# EAGLE design NanoRS485-MySens-v024 (EAGLE 7.6.0)
MAPLE-CUx Large Version
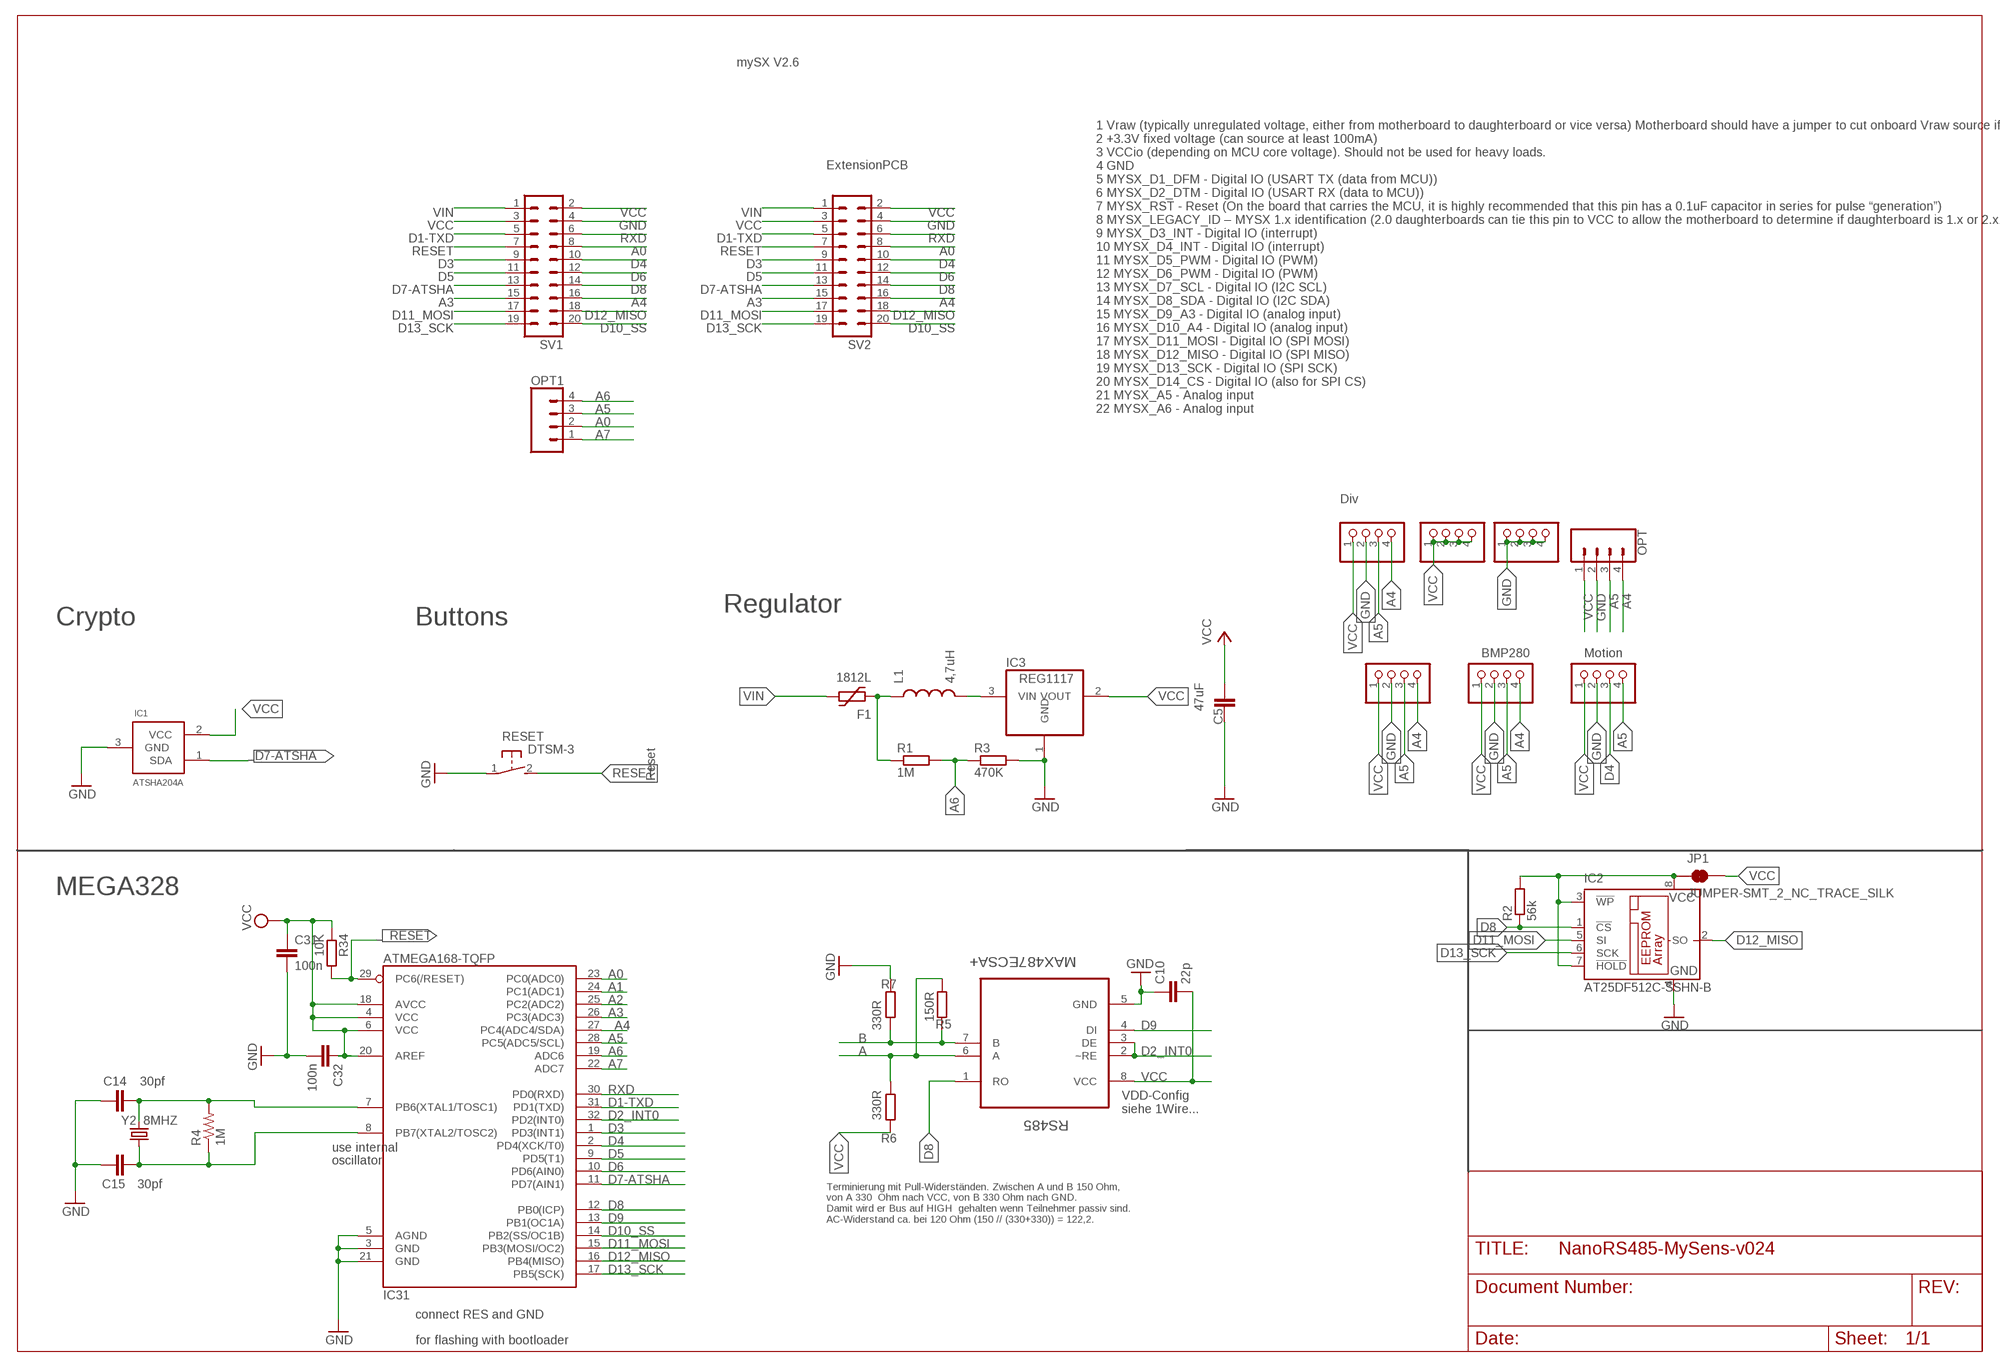
[diagram p0: schematic, sheet 1, part 1 of 2]
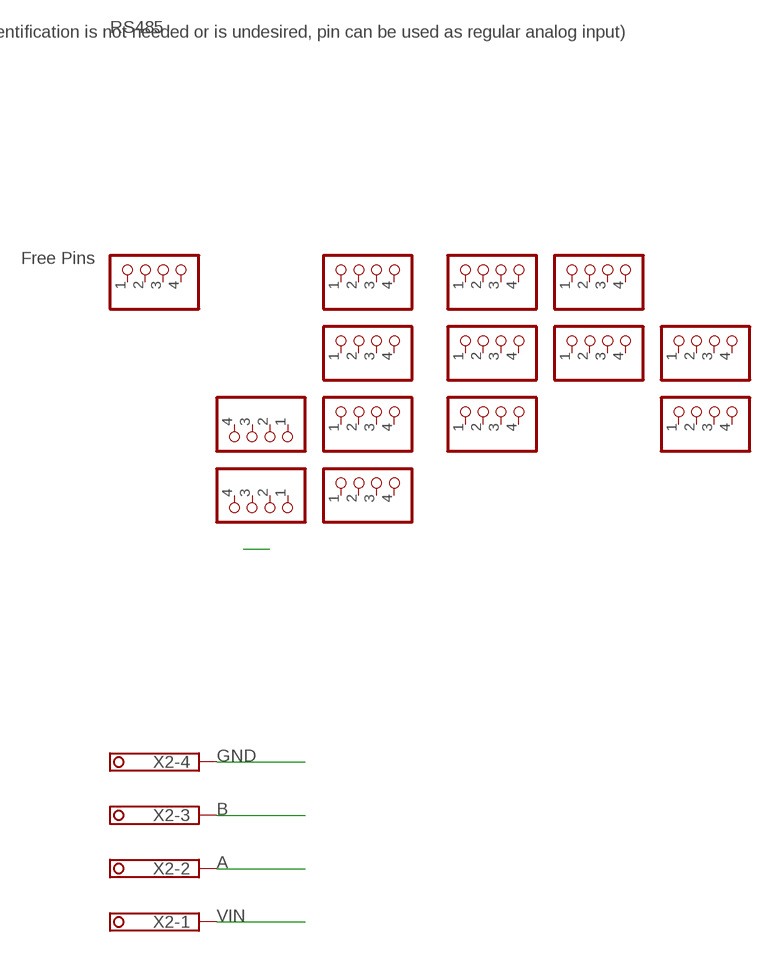
[diagram p1: schematic, sheet 1, part 2 of 2]

## Parts
BH1750  PINHD-1X04_2.54-S  [1X04-S]
C5  47uF  C-EUC1210  [C1210]
C10  22p  C-EUC0805  [C0805]
C14  30pf  CAP0805  [0805]
C15  30pf  CAP0805  [0805]
C31  100n  C-EUC0805  [C0805]
C32  100n  C-EUC0805  [C0805]
F1  1812L  [1812L]
I2C-1  PINHD-1X04_2.54-S  [1X04-S]
I2C-2  PINHD-1X04_2.54-S  [1X04-S]
IC1  ATSHA204A  [SOT23]
IC2  AT25DF512C-SSHN-B  25AA080SN  [SO-08]
IC3  REG1117  [SOT223]
IC31  ATMEGA168-TQFP  [TQFP32-08]
JP1  JUMPER-SMT_2_NC_TRACE_SILK  [SMT-JUMPER_2_NC_TRACE_SILK]
JP2  PINHD-1X04_2.54-S  [1X04-S]
JP3  PINHD-1X04_2.54-S  [1X04-S]
JP5  PINHD-1X04_2.54-S  [1X04-S]
JP6  PINHD-1X04_2.54-S  [1X04-S]
JP7  PINHD-1X04_2.54-S  [1X04-S]
JP8  PINHD-1X04_2.54-S  [1X04-S]
JP10  PINHD-1X04_2.54-S  [1X04-S]
JP13  PINHD-1X04_2.54-S  [1X04-S]
JP14  PINHD-1X04_2.54-S  [1X04-S]
JP15  PINHD-1X04_2.54-S  [1X04-S]
JP16  PINHD-1X04_2.54-S  [1X04-S]
JP18  PINHD-1X04_2.54-S  [1X04-S]
JP19  PINHD-1X04_2.54-S  [1X04-S]
JP20  PINHD-1X04_2.54-S  [1X04-S]
JP21  PINHD-1X04_2.54-S  [1X04-S]
JP23  PINHD-1X04_2.54-S  [1X04-S]
L1  4,7uH  INDUCTOR0805  [0805]
MOTION  PINHD-1X04_2.54-S  [1X04-S]
OPT  CONN_04  [1X04]
OPT1  CONN_04  [1X04]
R1  1M  R-EU_R0805  [R0805]
R2  56k  R-EU_M0805  [M0805]
R3  470K  R-EU_R0805  [R0805]
R4  1M  RESISTOR0805-RES  [0805]
R5  150R  R-EU_R0805  [R0805]
R6  330R  R-EU_R0805  [R0805]
R7  330R  R-EU_R0805  [R0805]
R34  10K  R-EU_R0805  [R0805]
RESET  DTSM-3  [DTSM-3]
RS485  MAX487ECSA+  [SOIC127P600X175-8N]
SV1  MA10-2  [MA10-2]
SV2  MA10-2  [MA10-2]
X2  1751264  [1751264]
Y2  8MHZ  CRYSTALTXC-7A  [CRYSTAL-TXC-7A]

## Nets
A: R5.1 R6.2 RS485.6(A) X2.2
A0: IC31.23(PC0(ADC0)) OPT1.2 SV1.8 SV2.8
A1: IC31.24(PC1(ADC1))
A2: IC31.25(PC2(ADC2))
A3: IC31.26(PC3(ADC3)) SV1.15 SV2.15
A4: BH1750.4 I2C-1.4 I2C-2.4 IC31.27(PC4(ADC4/SDA)) OPT.4 SV1.16 SV2.16
A5: BH1750.3 I2C-1.3 I2C-2.3 IC31.28(PC5(ADC5/SCL)) MOTION.4 OPT1.3 OPT.3
A6: IC31.19(ADC6) OPT1.4 R1.2 R3.1
A7: IC31.22(ADC7) OPT1.1
B: R5.2 R7.1 RS485.7(B) X2.3
D1-TXD: IC31.31(PD1(TXD)) SV1.5 SV2.5
D2_INT0: IC31.32(PD2(INT0)) RS485.2(~RE) RS485.3(DE)
D3: IC31.1(PD3(INT1)) SV1.9 SV2.9
D4: IC31.2(PD4(XCK/T0)) MOTION.3 SV1.10 SV2.10
D5: IC31.9(PD5(T1)) SV1.11 SV2.11
D6: IC31.10(PD6(AIN0)) SV1.12 SV2.12
D7-ATSHA: IC1.1(SDA) IC31.11(PD7(AIN1)) SV1.13 SV2.13
D8: IC2.1(!CS) IC31.12(PB0(ICP)) R2.1 RS485.1(RO) SV1.14 SV2.14
D9: IC31.13(PB1(OC1A)) RS485.4(DI)
D10_SS: IC31.14(PB2(SS/OC1B)) SV1.20 SV2.20
D11_MOSI: IC2.5(SI) IC31.15(PB3(MOSI/OC2)) SV1.17 SV2.17
D12_MISO: IC2.2(SO) IC31.16(PB4(MISO)) SV1.18 SV2.18
D13_SCK: IC2.6(SCK) IC31.17(PB5(SCK)) SV1.19 SV2.19
GND [PWR]: BH1750.2 C5.1 C10.1 C14.1 C15.1 C31.2 C32.2 I2C-1.2 I2C-2.2 IC1.3(GND) IC2.4(GND) IC3.1(GND) IC31.3(GND) IC31.5(AGND) IC31.21(GND) JP2.1 JP2.2 JP2.3 JP2.4 MOTION.2 OPT.2 R3.2 R7.2 RESET.1 RS485.5(GND) SV1.4 SV2.4 X2.4
N$3: C14.2 IC31.7(PB6(XTAL1/TOSC1)) R4.2 Y2.P$2
N$19: C15.2 IC31.8(PB7(XTAL2/TOSC2)) R4.1 Y2.P$1
RAW: IC3.3(VIN) L1.2
RESET: IC31.29(PC6(/RESET)) R34.2 RESET.2 SV1.7 SV2.7
RXD: IC31.30(PD0(RXD)) SV1.6 SV2.6
VCC [PWR]: BH1750.1 C5.2 C10.2 C31.1 C32.1 I2C-1.1 I2C-2.1 IC1.2(VCC) IC3.2(VOUT) IC31.4(VCC) IC31.6(VCC) IC31.18(AVCC) IC31.20(AREF) JP1.2 JP3.1 JP3.2 JP3.3 JP3.4 MOTION.1 OPT.1 R6.1 R34.1 RS485.8(VCC) SV1.2 SV1.3 SV2.2 SV2.3
VCC1 [PWR]: IC2.3(!WP) IC2.7(!HOLD) IC2.8(VCC) JP1.1 R2.2
VIN [PWR]: F1.P$2 SV1.1 SV2.1 X2.1
VIN-FUSED [PWR]: F1.P$1 L1.1 R1.1
Unconnected: JP5.1 JP5.2 JP5.3 JP5.4 JP6.1 JP6.2 JP6.3 JP6.4 JP7.1 JP7.2 JP7.3 JP7.4 JP8.1 JP8.2 JP8.3 JP8.4 JP10.1 JP10.2 JP10.3 JP10.4 JP13.1 JP13.2 JP13.3 JP13.4 JP14.1 JP14.2 JP14.3 JP14.4 JP15.1 JP15.2 JP15.3 JP15.4 JP16.1 JP16.2 JP16.3 JP16.4 JP18.1 JP18.2 JP18.3 JP18.4 JP19.1 JP19.2 JP19.3 JP19.4 JP20.1 JP20.2 JP20.3 JP20.4 JP21.1 JP21.2 JP21.3 JP21.4 JP23.1 JP23.2 JP23.3 JP23.4

## Notes on the sheet
- mySX V2.6
- ExtensionPCB
- RS485
- Free Pins
- 1 Vraw (typically unregulated voltage, either from motherboard to daughterboard or vice versa) Motherboard should have a jumper to cut onboard Vraw source if daughterboard provides Vraw. Be sure to check motherboard constraints on Vraw before connecting a daughterboard that provides Vraw (for over voltage protection). Should be able to source at least 100mA and all boards are recommended to support a voltage up to 24V on this pin.
  2 +3.3V fixed voltage (can source at least 100mA)
  3 VCCio (depending on MCU core voltage). Should not be used for heavy loads.
  4 GND
  5 MYSX_D1_DFM - Digital IO (USART TX (data from MCU))
  6 MYSX_D2_DTM - Digital IO (USART RX (data to MCU))
  7 MYSX_RST - Reset (On the board that carries the MCU, it is highly recommended that this pin has a 0.1uF capacitor in series for pulse “generation”)
  8 MYSX_LEGACY_ID – MYSX 1.x identification (2.0 daughterboards can tie this pin to VCC to allow the motherboard to determine if daughterboard is 1.x or 2.x. If identification is not needed or is undesired, pin can be used as regular analog input)
  9 MYSX_D3_INT - Digital IO (interrupt)
  10 MYSX_D4_INT - Digital IO (interrupt)
  11 MYSX_D5_PWM - Digital IO (PWM)
  12 MYSX_D6_PWM - Digital IO (PWM)
  13 MYSX_D7_SCL - Digital IO (I2C SCL)
  14 MYSX_D8_SDA - Digital IO (I2C SDA)
  15 MYSX_D9_A3 - Digital IO (analog input)
  16 MYSX_D10_A4 - Digital IO (analog input)
  17 MYSX_D11_MOSI - Digital IO (SPI MOSI)
  18 MYSX_D12_MISO - Digital IO (SPI MISO)
  19 MYSX_D13_SCK - Digital IO (SPI SCK)
  20 MYSX_D14_CS - Digital IO (also for SPI CS)
  21 MYSX_A5 - Analog input
  22 MYSX_A6 - Analog input
- Div
- Regulator
- Crypto | Buttons
- BMP280 | Motion
- Reset
- MEGA328
- VDD-Config
  siehe 1Wire...
- use internal
- oscillator
- Terminierung mit Pull-Widerständen. Zwischen A und B 150 Ohm,
  von A 330  Ohm nach VCC, von B 330 Ohm nach GND. 
  Damit wird er Bus auf HIGH  gehalten wenn Teilnehmer passiv sind.
  AC-Widerstand ca. bei 120 Ohm (150 // (330+330)) = 122,2.
- connect RES and GND
- for flashing with bootloader

## Library data of the parts
BH1750 I2C-1 I2C-2 JP2 JP3 JP5-JP8 JP10 JP13-JP16 JP18-JP21 JP23 MOTION = pinhead-2:PINHD-1X04: PIN HEADER
C5 C10 C31 C32 = rcl:C-EU: CAPACITOR, European symbol
C14 C15 = doug:CAP: Capacitor Standard 0603 ceramic capacitor, and 0.1" leaded capacitor.
F1 = ptc-littlefuse:1812L
IC1 = Sensor:ATSHA204A
IC2 = microchip:25*: Serial EEPROM 4K/ 8K , SPI bus; MF: MICROCHIP; MPN: 25AA080/SN; OC_FARNELL: 1816072; OC_NEWARK: 92C7351
IC3 = burr-brown:REG1117: 800mA and 1A Low Dropout (LDO) Positive Regulator 1.8V, 2.5V, 2.85V, 3.3V, 5V, and Adj; MPN: REG1117; OC_FARNELL: 1097566; OC_NEWARK: 14P6981
IC31 = atmel:ATMEGA168: Atmel Atmega 168/328/328P
JP1 = SparkFun-Jumpers:JUMPER-SMT_2_NC_TRACE: Normally closed trace jumper This jumper has a trace between two pads so it's normally closed (NC). Use a razor knife to open the connection. For best results follow the IPC guidelines for cutting traces: Cutout at least 0.063 mm (0.005 in). Remove all loose material to clean up the cut area. Seal the cut with an approved epoxy. Reapply solder to reclose the connection.
L1 = SparkFun-Passives:INDUCTOR: Inductors Basic Inductor/Choke - 0603 and 1206. Footprints are not proven and vary greatly between part numbers.
OPT OPT1 = SparkFun-Connectors:CONN_04: Multi connection point. Often used as Generic Header-pin footprint for 0.1 inch spaced/style header connections On any of the 0.1 inch spaced packages, you can populate with these: Break Away Headers - Straight <https://www.sparkfun.com/products/116> (PRT-00116) Break Away Male Headers - Right Angle <https://www.sparkfun.com/products/553> (PRT-00553) Female Headers <https://www.sparkfun.com/products/115> (PRT-00115) Break Away Headers - Machine Pin <https://www.sparkfun.com/products/117> (PRT-00117) Break Away Female Headers - Swiss Machine Pin <https://www.sparkfun.com/products/743> (PRT-00743) For SCREWTERMINALS and SPRING TERMINALS visit here: Screw Terimnals on SparkFun.com <https://www.sparkfun.com/search/results?term=Screw+Terminals> (5mm/3.5mm/2.54mm spacing) This device is also useful as a general connection point to wire up your design to another part of your project. Our various solder wires solder well into these plated through hole pads. Hook-Up Wire - Assortment (Stranded, 22 AWG) <https://www.sparkfun.com/products/11375> (PRT-11375) Hook-Up Wire - Assortment (Solid Core, 22 AWG) <https://www.sparkfun.com/products/11367> (PRT-11367) View the entire wire category on our website here <https://www.sparkfun.com/categories/141> Special notes: Molex polarized connector foot print use with SKU : PRT-08231 with associated crimp pins and housings. 1MM SMD Version SKU: PRT-10208; PROD_ID: CONN-09696
R1 R3 R5-R7 R34 = rcl:R-EU_: RESISTOR, European symbol
R2 = resistor:R-EU_: RESISTOR, European symbol
R4 = doug:RESISTOR: Resistor Basic schematic elements and footprints for 0603, 1206, and PTH resistors.
RESET = mechanics:DTSM-3: Diptronics SMD button 6x3.5 mm
RS485 = Maxim_By_element14_Batch_1:MAX487ECSA+: Low-Power, Slew-Rate-Limited RS-485/RS-422 Transceivers; MPN: MAX487ECSA+; OC_FARNELL: 9724532; OC_NEWARK: 68K4803; PACKAGE: SOIC-8; SUPPLIER: Maxim
SV1 SV2 = con-lstb:MA10-2: PIN HEADER; OC_FARNELL: unknown; OC_NEWARK: unknown
X2 = con-phoenix-350:1751264: MKDS 1/ 4-3,5 Printklemme Nennstrom: 10 A Bemessungsspannung: 160 V Raster: 3,5 mm Polzahl: 4 Montageart: Löten Anschlussart: Schraubanschluss Anschlussrichtung vom Leiter zur Platine: 0° Source: http://eshop.phoenixcontact.com .. 1751264.pdf; MPN: 1751264; OC_FARNELL: unknown; OC_NEWARK: 10R0934
Y2 = SparkFun-FreqCtrl:CRYSTAL: Various standard crystals. Proven footprints.

## Net classes
0 default: width 0.254 mm
1 PWR: width 0.406 mm

## Board
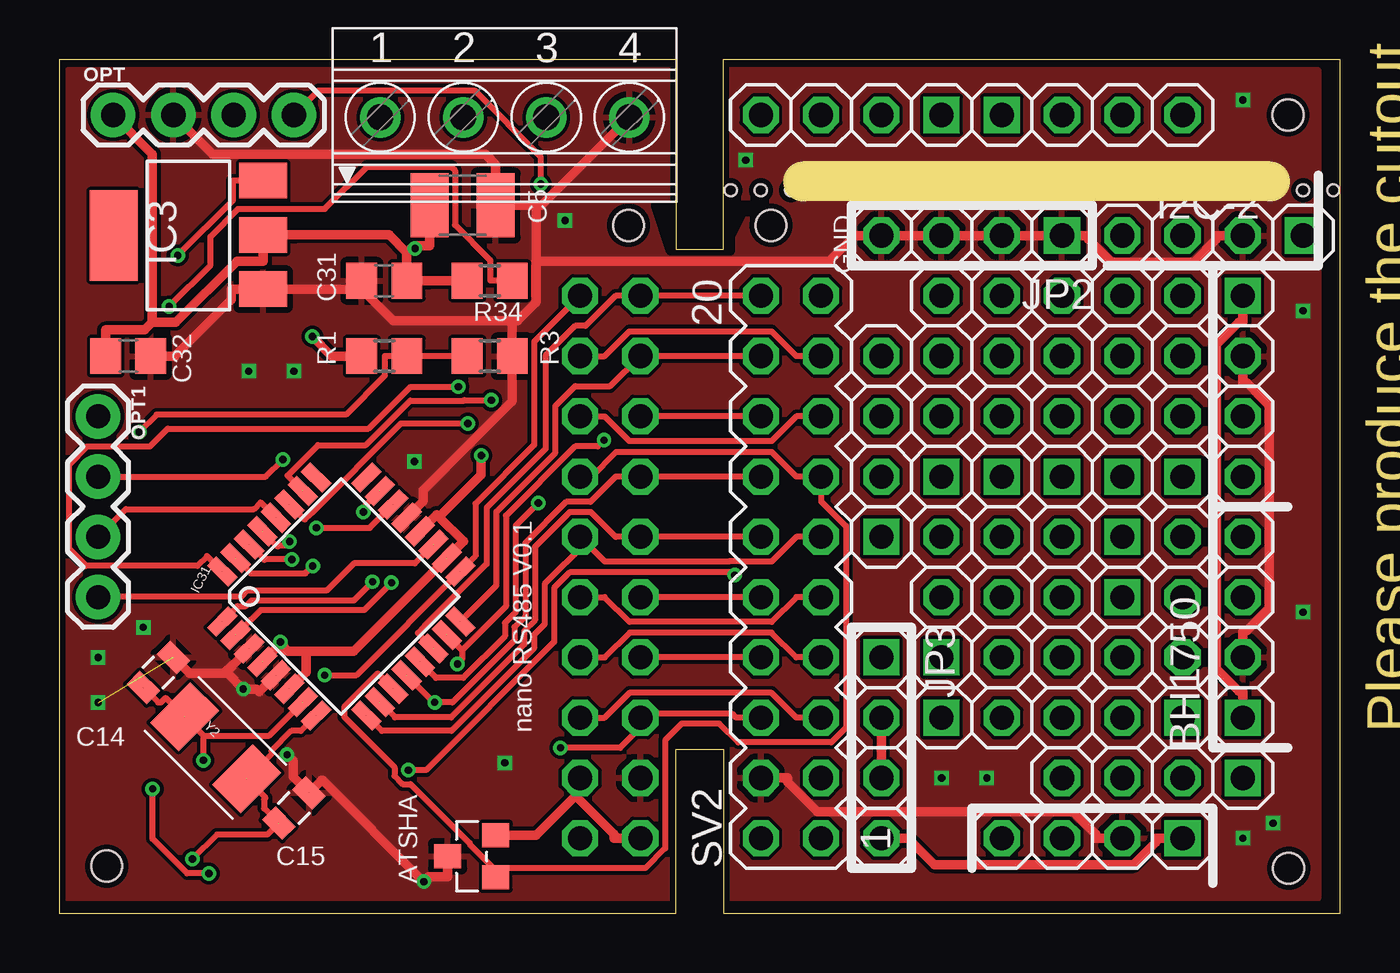
[diagram p2: board, top side]
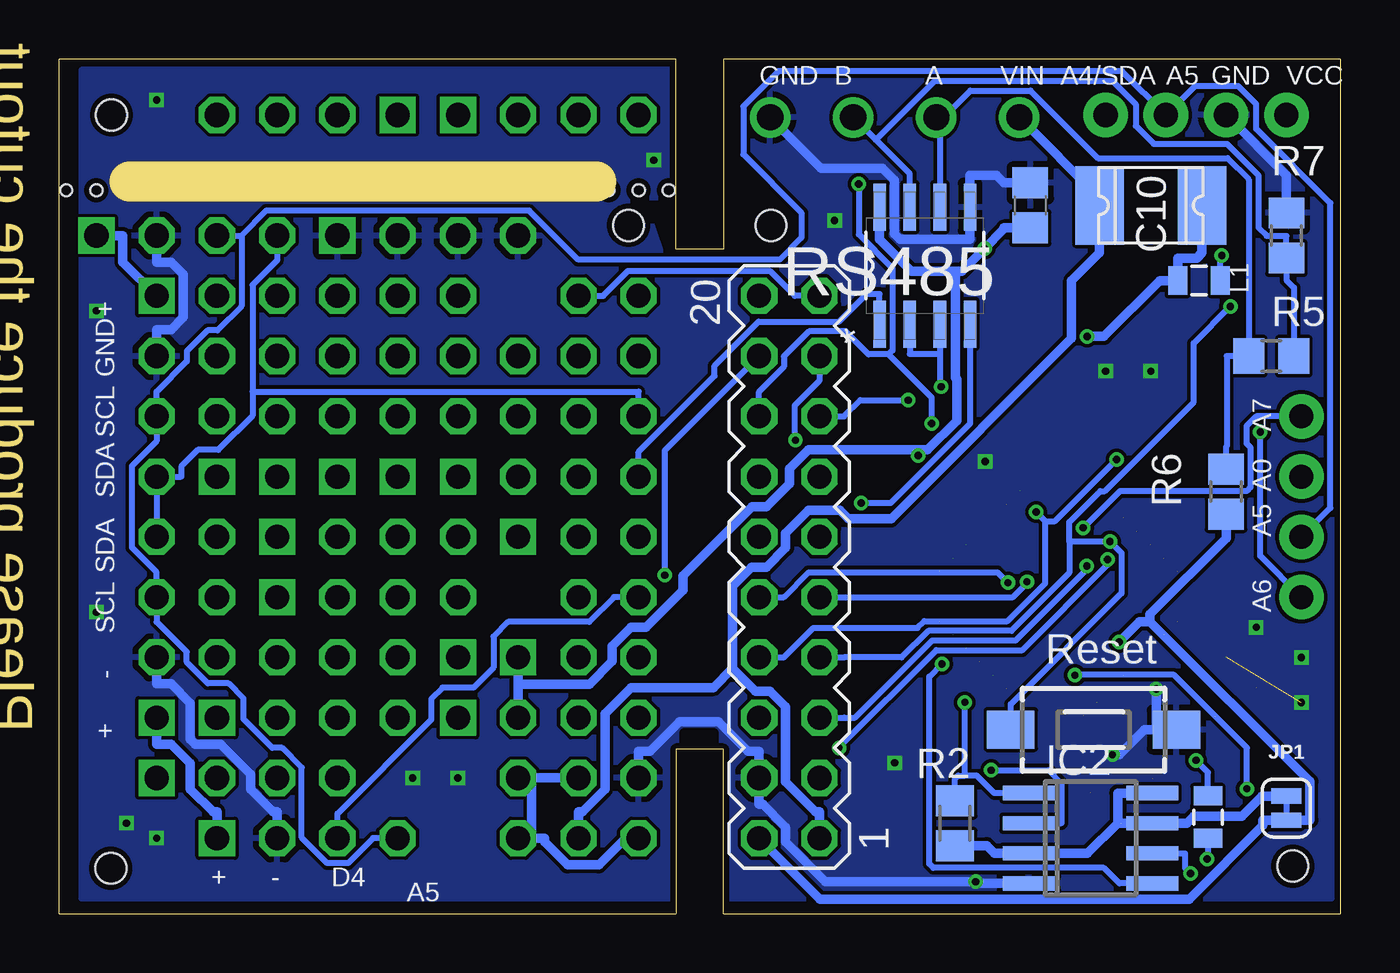
[diagram p3: board, bottom side, seen from below]

Size 54 x 36 mm. Coordinates in mm from the lower left corner, seen from the top.
Outline: 26,0 0,0 0,36 26,36 26,28 28,28 28,36 54,36 54,0 28,0 28,6.92 26,6.92 26,0
Copper layers (1*16): Top 0.035mm / dielectric 1.5mm / Bottom 0.035mm
Design rules "SeeedStudio_2layer_DRU_no_angle_20140221": minimum track width 6mil, minimum drill 12mil, track to track 6mil, track to pad 6mil, pad to pad 6mil, via to via 6mil, smd to smd 0mil, copper to edge 10mil, drill to drill 10mil, minimum pad ring 10mil, minimum via ring 6mil, stop-mask expansion 2mil, vias tented up to drill 100mil, thermal gap 10mil
Holes 1.3 mm at 24,29 2,2 30,29 51.83,1.91 51.8,33.66
Holes 0.5 mm at 28.3,30.48 30.84,30.48 29.57,30.48 52.44,30.48 53.7,30.48
tRestrict: area 25.1,27.9 to 28.9,29.8; area 26.4,7 to 27.7,7.6
bRestrict: area 25.1,27.9 to 28.9,29.8; area 26.4,7 to 27.7,7.6
Milling: 1 lines

### Footprints (pad centres in the part's own frame; a part is rotated, then mirrored left to right if it is on the bottom)
1X04-S = drill 1.016 square: 1 -3.81,0 | drill 1.016 octagon: 2 -1.27,0; 3 1.27,0; 4 3.81,0
C1210 = smd 1.6 x 2.7: 1 -1.4,0; 2 1.4,0
C0805 = smd 1.3 x 1.5: 1 -0.95,0; 2 0.95,0
0805 = smd 0.8 x 1.2: 1 -0.9,0; 2 0.9,0
1812L = smd 2.03 x 3.3: P$1 -2.16,0; P$2 2.16,0
SOT23 = smd 1.016 x 1.143: 1 -0.889,-1.016; 2 0.889,-1.016; 3 0,1.016
SO-08 = smd 0.6 x 2.2: 1 -1.905,-2.6; 2 -0.635,-2.6; 3 0.635,-2.6; 4 1.905,-2.6; 5 1.905,2.6; 6 0.635,2.6; 7 -0.635,2.6; 8 -1.905,2.6
SOT223 = smd 1.499 x 2.007: 1 -2.261,-3.15; 2 0.025,-3.15; 3 2.311,-3.15 | smd 3.81 x 2.007: 4 0,3.15
TQFP32-08 = smd 1.27 x 0.559: 1 -4.293,2.8; 2 -4.293,2; 3 -4.293,1.2; 4 -4.293,0.4; 5 -4.293,-0.4; 6 -4.293,-1.2; 7 -4.293,-2; 8 -4.293,-2.8; 17 4.293,-2.8; 18 4.293,-2; 19 4.293,-1.2; 20 4.293,-0.4; 21 4.293,0.4; 22 4.293,1.2; 23 4.293,2; 24 4.293,2.8 | smd 0.559 x 1.27: 9 -2.8,-4.293; 10 -2,-4.293; 11 -1.2,-4.293; 12 -0.4,-4.293; 13 0.4,-4.293; 14 1.2,-4.293; 15 2,-4.293; 16 2.8,-4.293; 25 2.8,4.293; 26 2,4.293; 27 1.2,4.293; 28 0.4,4.293; 29 -0.4,4.293; 30 -1.2,4.293; 31 -2,4.293; 32 -2.8,4.293
SMT-JUMPER_2_NC_TRACE_SILK = smd 0.635 x 1.27: 1 -0.508,0; 2 0.508,0
1X04 = drill 1.016 pad 1.88: 1 0,0; 2 2.54,0; 3 5.08,0; 4 7.62,0
R0805 = smd 1.3 x 1.5: 1 -0.95,0; 2 0.95,0
M0805 = smd 1.3 x 1.6: 1 -0.95,0; 2 0.95,0
DTSM-3 = smd 2 x 1.6: 1 -3.494,0; 2 3.494,0
SOIC127P600X175-8N = smd 1.981 x 0.533: 1 -2.464,1.905; 2 -2.464,0.635; 3 -2.464,-0.635; 4 -2.464,-1.905; 5 2.464,-1.905; 6 2.464,-0.635; 7 2.464,0.635; 8 2.464,1.905
MA10-2 = drill 1.016 octagon: 1 -11.43,-1.27; 2 -11.43,1.27; 3 -8.89,-1.27; 4 -8.89,1.27; 5 -6.35,-1.27; 6 -6.35,1.27; 7 -3.81,-1.27; 8 -3.81,1.27; 9 -1.27,-1.27; 10 -1.27,1.27; 11 1.27,-1.27; 12 1.27,1.27; 13 3.81,-1.27; 14 3.81,1.27; 15 6.35,-1.27; 16 6.35,1.27; 17 8.89,-1.27; 18 8.89,1.27; 19 11.43,-1.27; 20 11.43,1.27
1751264 = drill 1.1 pad 1.7: 1 -5.25,-0.1; 2 -1.75,-0.1; 3 1.75,-0.1; 4 5.25,-0.1
CRYSTAL-TXC-7A = smd 1.7 x 2.4: P$1 1.85,0; P$2 -1.85,0

### Placement (x,y rotation side)
BH1750  49.9,12.06 90 top
C5  17,29.84 180 top
C10  13.06,29.84 270 bottom
C14  4.17,10.16 225 top
C15  9.89,4.45 225 top
C31  13.7,26.67 180 top
C32  2.91,23.5 0 top
F1  7.99,29.84 180 bottom
I2C-1  49.9,22.23 270 top
I2C-2  48.62,28.57 180 top
IC1  17.38,2.41 90 top
IC2  10.53,3.17 270 bottom
IC3  5.45,28.57 90 top
IC31  11.89,13.36 45 top
JP1  2.27,4.45 270 bottom
JP2  38.47,28.57 180 top
JP3  34.66,6.99 270 top
JP5  43.55,33.66 0 top
JP6  37.2,22.23 90 top
JP7  41.01,8.26 0 top
JP8  39.73,22.23 90 top
JP10  41.01,15.88 180 top
JP13  42.27,22.23 90 top
JP14  44.81,22.23 90 top
JP15  47.35,22.23 90 top
JP16  33.38,33.66 180 top
JP18  34.66,19.68 90 top
JP19  47.35,12.06 90 top
JP20  46.09,5.71 180 top
JP21  41.01,13.34 180 top
JP23  41.01,10.79 0 top
L1  5.95,26.67 0 bottom
MOTION  43.55,3.17 180 top
OPT  2.27,33.66 0 top
OPT1  1.64,20.95 270 top
R1  13.7,23.5 0 top
R2  16.24,3.81 270 bottom
R3  18.14,23.5 0 top
R4  5.57,4.06 90 bottom
R5  2.91,23.5 0 bottom
R6  4.81,17.78 90 bottom
R7  2.27,28.57 90 bottom
R34  18.14,26.67 0 top
RESET  10.4,7.75 180 bottom
RS485  17.51,27.3 90 bottom
SV1  23.23,14.61 90 bottom
SV2  30.84,14.61 90 top
X2  18.78,33.66 0 top
Y2  6.59,6.99 315 top

### Tracks (layer width: path | path; a pad name or v marks a point on that pad's centre or on a via)
A
  Bottom 0.254: R6.2 4.81,19.66 4.78,19.68 4.78,23.5 R5.1 3.85,30.94 4.75,31.83 10.21,31.83 13.06,34.69 15.59,34.69 16.88,33.4 | 16.88,33.4 RS485.6 | X2.2 16.88,33.4
A0  (via drill 0.3 pad 0.61)  (1 unrouted)
  Top 0.254: OPT1.2 8.71,18.41 v9.43,19.13 | v12.82,16.93 12.86,16.97 12.86,17.16 | 12.86,17.16 | IC31.23 12.86,17.16 | SV2.8 SV1.8
  Bottom 0.254: 12.43,16.54 v12.82,16.93 | 12.43,16.54 12.43,13.92 14.03,12.32 17.53,12.32 17.82,12.04 22.21,12.04 23.45,10.79 SV1.8 | 12.43,16.54 12.02,16.54 v9.43,19.13
A3  (via drill 0.3 pad 0.61)  (1 unrouted)
  Top 0.254: v18.21,21.64 17.09,21.64 17.07,21.62 14.79,21.62 12.92,19.74 10.9,19.74 9.62,18.46 IC31.26 | SV1.15 23,20.95 24.04,19.91 30.03,19.91 31.07,20.95 SV2.15
  Bottom 0.254: v18.21,21.64 20.23,21.64 20.91,20.95 SV1.15
A4  (via drill 0.3 pad 0.61)  (1 unrouted)
  Top 0.254: 16.94,20.66 14.41,20.66 10.63,16.88 10.35,16.6 IC31.27 | 16.94,20.66 | 16.94,20.66 v17.22,20.66 | OPT.4 10.92,34.69 17.5,34.69 20.3,31.89 v20.3,30.75 | SV2.16 SV1.16
  Bottom 0.254: v17.22,20.66 17.22,21.74 19.04,23.56 | 19.04,23.56 19.88,23.56 20.86,24.54 22.39,24.54 23.45,23.48 23.45,23.04 24.5,22 SV1.16 | v20.3,30.75 20.3,28.62 18.87,27.19 18.87,23.73 19.04,23.56 | 45.86,22 45.86,20.98 47.29,19.54 48.16,19.54 48.85,18.85 48.85,18.41 I2C-1.4 BH1750.4 | 45.86,22 45.86,26.49 44.81,27.53 I2C-2.4 | 45.86,22 29.57,22 SV2.16
A5  (1 unrouted)
  Top 0.254: IC31.28 8.49,17.33 8.2,17.04 2.8,17.04 OPT1.3
  Bottom 0.254: OPT1.3 0.42,17.09 0.42,29.94 3.54,33.07 3.54,34.11 4.3,34.88 6.13,34.88 OPT.3 9.2,35.5 23.68,35.5 25.16,34.02 25.16,31.99 22.71,29.54 22.71,28.47 23.62,27.56 32.13,27.56 34.19,29.62 45.27,29.62 46.31,28.57 | 46.31,28.57 46.31,25.6 47.34,24.58 47.75,24.58 48.62,23.7 48.62,23.27 49.9,22 I2C-1.3 49.9,19.91 50.94,18.87 50.94,15.42 49.9,14.38 BH1750.3 49.9,12.29 48.62,11.02 48.62,10.59 47.74,9.7 46.87,9.7 46.23,9.05 46.23,8.19 45.02,6.99 44.61,6.99 43.77,6.15 43.77,3.2 42.7,2.13 41.82,2.13 40.78,3.17 MOTION.4 | I2C-2.3 46.31,28.57
A6  (via drill 0.3 pad 0.61)  (1 unrouted)
  Top 0.254: IC31.19 14.98,14.76 12.42,14.76 11.27,13.61 7.93,13.61 7.68,13.36 1.66,13.36 OPT1.4 | v3.37,20.3 4.11,21.03 12.08,21.03 13.72,22.67 13.72,23.5 R1.2 R3.1
  Bottom 0.254: OPT1.4 3.37,15.07 v3.37,20.3
A7  (via drill 0.3 pad 0.61)  (1 unrouted)
  Top 0.254: v10.83,16.25 13.08,16.25 IC31.22
  Bottom 0.254: OPT1.1 3.54,20.95 3.96,20.54 3.96,19.82 3.78,19.64 3.78,17.96 3.94,17.8 9.29,17.8 v10.83,16.25
B
  Bottom 0.254: 19.58,32.6 17.09,35.09 9.6,35.09 8.62,34.11 8.62,33.2 7.86,32.44 4.78,32.44 3.45,31.11 3.45,28.91 3.1,28.55 2.27,28.55 R7.1 2.27,26.7 1.96,26.38 R5.2 | 19.58,32.6 X2.3 | RS485.7 18.14,31.17 19.58,32.6
D1-TXD  (via drill 0.3 pad 0.61)  (1 unrouted)
  Top 0.254: v10.69,14.65 10.53,14.49 10.52,14.49 10.37,14.34 8.09,14.34 8.08,14.34 IC31.31 | v10.69,14.65 | SV1.5 23,8.26 24.04,9.3 30.03,9.3 31.07,8.26 SV2.5
  Bottom 0.254: v10.69,14.65 10.69,14.51 13.68,11.51 17.2,11.51 20.45,8.26 20.91,8.26 SV1.5
D2_INT0  (via drill 0.3 pad 0.61)  (1 unrouted)
  Top 0.254: v16.82,22.2 14.8,22.2 13.04,20.44 4.58,20.44 3.82,19.68 1.18,19.68 0.41,18.92 0.41,15.37 1.13,14.65 5.81,14.65 6.22,15.06 IC31.32
  Bottom 0.254: 16.88,23.57 16.88,22.25 v16.82,22.2 | 16.88,23.57 18.14,23.57 RS485.2 | RS485.3 16.88,23.57
D3  (via drill 0.3 pad 0.61)  (1 unrouted)
  Top 0.254: v13.2,13.98 12.42,13.2 8.11,13.2 7.86,12.95 7.52,12.95 IC31.1 | SV1.9 23,13.34 24.04,12.29 30.03,12.29 31.07,13.34 SV2.9
  Bottom 0.254: SV1.9 13.79,13.34 13.2,13.92 v13.2,13.98
D4  (via drill 0.3 pad 0.61)  (1 unrouted)
  Top 0.254: IC31.2 8.08,12.39 8.49,12.79 12.85,12.79 v14.01,13.95 | SV2.10 SV1.10
  Bottom 0.254: v14.01,13.95 14.44,14.38 22.41,14.38 23.45,13.34 SV1.10 | MOTION.3 42.27,4.22 38.32,8.17 38.32,9.05 37.84,9.53 36.54,9.53 35.7,10.37 35.7,11.67 35.08,12.29 31.66,12.29 30.62,13.34 SV2.10
D5  (1 unrouted)
  Top 0.254: 22.2,15.63 SV1.11 | 22.2,15.63 23,14.83 28.22,14.83 28.23,14.84 28.72,14.84 28.73,14.83 30.03,14.83 31.07,15.88 SV2.11 | 22.2,15.63 20.46,13.89 20.46,12.2 20.01,11.75 20.01,11.17 16.53,7.7 13.59,7.7 IC31.9
D6  (1 unrouted)
  Top 0.254: IC31.10 14.15,8.27 16.52,8.27 19.6,11.35 19.6,11.92 20.05,12.37 20.05,15.45 21.52,16.92 22.41,16.92 23.45,15.88 SV1.12 SV2.12
D7-ATSHA  (1 unrouted)
  Top 0.254: 18.4,1.92 18.31,1.92 17.3,2.93 17.3,2.97 14.81,5.46 14.48,5.46 14.13,5.8 14.13,6.17 12.02,8.29 12.02,8.71 13.43,10.12 IC31.11 | 18.4,1.92 24.71,1.92 25.54,2.75 25.54,7.3 26.24,8 27.83,8 28.62,7.21 32.55,7.21 33.16,7.82 33.16,16.32 32.11,17.37 SV2.13 31.07,18.41 30.03,19.46 23.48,19.46 22.43,18.41 SV1.13 | IC1.1 18.4,1.92
D8  (via drill 0.3 pad 0.61)  (1 unrouted)
  Top 0.254: SV2.14 SV1.14 23.45,18.41 22.39,17.35 21.37,17.35 19.65,15.62 19.65,12.54 19.19,12.09 19.19,11.52 16.57,8.9 v15.83,8.9 15.78,8.9 15.29,9.4 IC31.12
  Bottom 0.254: RS485.1 19.41,26.11 19.96,26.11 21.13,24.95 24.52,24.95 26.37,23.09 26.37,22.66 29.57,19.46 SV2.14 | 15.83,5.82 15.32,5.82 14.58,5.08 14.5,5.08 IC2.1 | 15.83,5.82 16.11,5.82 16.24,5.69 R2.1 | 15.83,5.82 v15.83,8.9
D9  (via drill 0.3 pad 0.61)  (1 unrouted)
  Top 0.254: v20.19,17.3 19.24,16.35 19.24,12.71 18.79,12.25 18.79,11.69 17.03,9.93 15.88,9.93 IC31.13
  Bottom 0.254: v20.19,17.3 18.95,17.3 15.61,20.65 15.61,23.57 RS485.4
D10_SS  (1 unrouted)
  Top 0.254: SV2.20 SV1.20 23.45,26.04 22.18,24.77 21.75,24.77 20.51,23.52 20.51,19.59 18.02,17.11 18.02,14.74 15.41,12.13 15.41,12.11 15.12,11.82 IC31.14
D11_MOSI  (via drill 0.3 pad 0.61)  (1 unrouted)
  Top 0.254: v22.96,19.95 22.7,19.68 21.75,19.68 18.83,16.77 18.83,12.94 16.98,11.09 | SV1.17 23,23.5 24.04,24.54 30.03,24.54 31.07,23.5 SV2.17 | 16.98,11.09 16.98,10.72 v16.79,10.52 | IC31.15 16.98,11.09
  Bottom 0.254: v22.96,19.95 23,19.99 23,21.41 21.95,22.45 SV1.17 | v16.79,10.52 17.32,9.98 17.32,2.1 17.16,1.93 9.96,1.93 9.3,1.27 IC2.5
D12_MISO  (via drill 0.3 pad 0.61)  (1 unrouted)
  Top 0.254: IC31.16 18.43,13.83 18.43,16.94 20.91,19.43 20.91,21.39 21.75,22.23 23.23,22.23 SV1.18 SV2.18 | v28.48,14.26 28.36,14.38 21.52,14.38 20.87,13.72 20.87,11.45 15.46,6.04 v14.72,6.04
  Bottom 0.254: IC2.2 11.75,3.81 11.75,5.5 12.29,6.04 v14.72,6.04 | SV1.18 28.48,19.51 v28.48,14.26
D13_SCK  (via drill 0.3 pad 0.61)  (1 unrouted)
  Top 0.254: SV1.19 20.02,24.1 20.02,19.75 17.55,17.28 17.55,15.06 IC31.17 12.53,10.04 v11.19,10.04 | v6.31,1.69 5.39,1.69 3.93,3.15 v3.93,5.25
  Bottom 0.254: SV1.19 23,26.04 24.04,27.08 30.03,27.08 31.07,26.04 SV2.19 | IC2.6 6.55,2.54 6.55,1.93 v6.31,1.69 | v3.93,5.25 3.93,6.98 7.01,10.05 11.18,10.05 v11.19,10.04
GND  (via drill 0.3 pad 0.61)  (5 unrouted)
  Top 0.406: IC31.5 8.43,9.34 8.32,9.46 v7.75,9.46 7.09,10.12 6.97,10.12 | 6.97,10.12 6.97,10.14 7.3,10.47 IC31.3 | 6.97,10.12 5.49,10.12 C14.1 | 6.97,10.12 | 20.1,29.84 20.33,29.84 X2.4 | X2.4 | 20.1,29.84 19.56,29.84 C5.1 18.4,31.55 17.96,31.99 6.47,31.99 OPT.2 | 20.1,29.84 20.1,27.48 | 20.1,27.48 20.1,25.77 19.32,24.99 19.09,24.99 | 20.1,27.48 32.44,27.48 33.54,28.57 JP2.4 JP2.3 JP2.2 JP2.1 43.39,28.57 43.39,28.41 44.34,27.46 47.83,27.46 48.78,28.41 48.78,28.57 I2C-2.2 | 19.09,24.99 14.08,24.99 12.75,26.31 | 19.09,24.99 19.09,24.6 R3.2 19.09,22.39 19.09,21.59 15.34,17.83 15.34,17.38 IC31.21 | SV2.4 30.69,5.71 30.69,5.56 31.96,4.29 42.75,4.29 43.7,3.34 43.7,3.17 MOTION.2 | 12.75,26.31 9.95,26.31 IC3.1 7.24,26.31 7.24,25.87 4.86,23.5 C32.2 | C31.2 12.75,26.31 | IC1.3 16.37,1.55 15.57,1.55 v15.36,1.35 11.09,5.62 11.06,5.62 C15.1 9.85,5.76 9.85,6.45 v9.61,6.69 | I2C-1.2 49.9,22.38 50.05,22.38 51.02,21.41 51.02,12.87 50.06,11.91 49.9,11.91 BH1750.2
  Bottom 0.406: 7.58,7.75 7.75,7.92 v7.75,9.46 | 7.58,7.75 8.26,7.75 9.31,6.69 v9.61,6.69 | RESET.1 7.58,7.75 | R7.2 2.27,30.53 2.27,31.11 OPT.2 | X2.4 21.88,31.41 19.29,31.41 18.79,30.91 18.79,28.66 18.56,28.42 15.61,28.42 RS485.5 15.61,31.11 14.49,31.11 14.17,30.8 C10.1 | SV2.4 29.57,6.83 29.11,6.83 27.86,8.08 26.2,8.08 24.96,6.83 24.5,6.83 SV1.4 24.5,4.6 24.33,4.6 23.38,3.65 23.38,3.02 21.71,1.35 v15.36,1.35 15.29,1.27 IC2.4 | I2C-1.2 49.9,24.61 49.29,24.61 48.78,25.12 48.78,26.95 49.28,27.46 49.9,27.46 I2C-2.2 | BH1750.2 49.9,9.68 49.29,9.68 48.47,8.86 48.47,7.34 48.27,7.14 47.2,7.14 45.93,5.87 45.93,5.24 44.98,4.29 44.81,4.29 MOTION.2
  other vias: 1.64,8.89 1.64,10.79 3.54,12.06 7.99,22.86 9.89,22.86 37.2,5.71 39.1,5.71 49.9,3.17 51.16,3.81 49.9,34.29 52.44,25.4 52.44,12.7 28.94,31.75 18.78,6.35 21.32,29.21 14.97,19.05
  pour Top: 0.36,35.56 53.07,35.56 53.07,0.64 0.36,0.64
  pour Bottom: 0.36,35.56 53.07,35.56 53.07,0.64 0.36,0.64
N$3  (via drill 0.3 pad 0.61)  (3 unrouted)
  Top 0.254: v6.08,6.46 6.08,7.5 | 6.08,7.5 Y2.P$2 4.48,9.09 4.29,8.9 4.16,8.9 C14.2 | 6.08,7.5 8.85,7.5 IC31.7
  Bottom 0.254: R4.2 5.57,5.95 v6.08,6.46
N$19  (via drill 0.3 pad 0.61)  (3 unrouted)
  Top 0.254: v5.61,2.3 6.64,3.33 8.77,3.33 C15.2 8.63,4.43 8.63,4.82 8.7,4.88 Y2.P$1 8.94,6.72 | 8.94,6.72 8.94,6.86 9.78,7.7 10.19,7.7 IC31.8 | 8.94,6.72
  Bottom 0.254: v5.61,2.3 5.61,2.45 5.57,2.48 R4.1
RAW  (via drill 0.3 pad 0.61)
  Top 0.254: v5,27.73 7.31,30.05 7.31,30.89 IC3.3
  Bottom 0.254: L1.2 5.05,27.55 5,27.61 v5,27.73
RESET  (via drill 0.3 pad 0.61)  (1 unrouted)
  Top 0.254: v4.63,25.59 6.38,27.33 6.38,28.53 7.54,29.7 11.2,29.7 12.97,31.47 16.53,31.47 16.68,31.32 16.68,29.02 18.17,27.54 18.17,26.67 R34.2 | v9.71,15.68 9.54,15.51 9.26,15.51 9.21,15.47 IC31.29 | SV1.7 23,10.79 24.04,11.84 30.03,11.84 31.07,10.79 SV2.7
  Bottom 0.254: 11.42,15.67 11.42,14.35 13.86,11.92 17.36,11.92 18.49,10.79 20.91,10.79 SV1.7 | 11.42,15.67 v9.72,15.67 v9.71,15.68 9.22,15.2 9.22,13.49 13.89,8.83 RESET.2 | 11.42,15.67 11.42,16.49 10.12,17.8 9.93,17.8 6.17,21.55 6.17,24.04 v4.63,25.59
RXD  (via drill 0.3 pad 0.61)  (1 unrouted)
  Top 0.254: SV2.6 28.53,8.26 28.38,8.41 25.07,8.41 24.91,8.26 | IC31.30 8.65,14.9 8.67,14.92 v9.81,14.92 | 24.91,8.26 23.64,6.99 v21.13,6.99 | SV1.6 24.91,8.26
  Bottom 0.254: v21.13,6.99 21.13,7 17.03,11.11 13.4,11.11 9.81,14.69 v9.81,14.92
VCC  (via drill 0.3 pad 0.61)  (3 unrouted)
  Top 0.406: 9.32,11.37 v9.32,11.44 | 9.32,11.37 9.17,11.21 IC31.4 | 9.32,11.37 9.64,11.05 10.4,11.05 | IC31.20 15.91,16.81 16.01,16.71 | 16.01,16.71 17.04,15.68 IC31.18 12.41,11.05 10.4,11.05 | v17.79,19.31 17.79,18.49 16.01,16.71 | 14.65,27.86 14.82,28.03 v15,28.03 15.11,28.14 15.6,28.14 C5.2 | 14.65,27.86 13.91,28.6 9.95,28.6 IC3.2 8.59,27.5 7.49,27.5 4.92,24.92 3.92,24.92 | 14.65,27.86 14.65,27.78 C31.1 15.66,26.67 16.19,26.67 R34.1 | 3.92,24.92 3.6,24.6 1.96,24.6 C32.1 | OPT.1 3.92,32.01 3.92,24.92 | MOTION.1 46.24,3.17 46.24,3.01 45.29,2.06 36.89,2.06 35.77,3.17 JP3.4 | I2C-1.1 49.9,24.92 49.73,24.92 48.78,23.97 48.78,10.32 49.73,9.37 49.9,9.37 BH1750.1 | 21.76,4.96 20.1,3.3 IC1.2 | SV1.3 21.95,5.16 21.76,4.96 | 21.76,4.96 23.38,3.34 23.38,3.17 SV1.2 | IC31.6 10.4,10.18 | JP3.3 JP3.2 | 10.4,10.18 | 10.4,10.18 10.4,11.05
  Bottom 0.406: 8.02,12.31 8.02,12.62 4.81,15.82 R6.1 | 8.02,12.31 1.28,5.57 1.28,3.94 JP1.2 2.76,3.94 3.26,3.94 3.26,3.71 6.36,0.61 21.93,0.61 SV1.2 | 8.02,12.31 8.46,12.31 v9.32,11.44 | 17.79,19.54 17.4,19.54 16.16,20.78 16.16,22.51 16.23,22.57 16.23,27.08 | 34.66,9.67 31.65,9.67 30.69,10.63 30.69,11.26 29.89,12.06 29.26,12.06 27.71,13.62 27.71,14.24 24.81,17.14 24.18,17.14 23.21,18.11 23.21,18.74 22.41,19.54 17.79,19.54 | 17.79,19.54 v17.79,19.31 | RS485.8 19.41,28.42 18.07,27.08 16.23,27.08 | 16.23,27.08 15.95,27.08 v15,28.03 14.17,28.85 14.17,28.89 C10.2 | 34.66,9.67 JP3.1 | JP3.2 34.66,9.67 | 34.1,5.71 33.54,5.71 SV2.3 | JP3.3 34.1,5.71 | 34.1,3.17 33.54,3.17 33.54,3.02 32.58,2.06 31.25,2.06 30.13,3.17 SV2.2 | JP3.4 34.1,3.17 | 34.1,5.71 34.1,3.17 | I2C-2.1 51.32,28.57 51.32,27.46 I2C-1.1 | BH1750.1 49.9,7.14 49.28,7.14 48.47,6.33 48.47,5.24 47.52,4.29 47.35,4.29 MOTION.1
VCC1
  Bottom 0.406: R2.2 14.9,2.86 14.58,2.54 IC2.3 10.65,2.54 9.38,3.81 | JP1.1 3.3,4.95 4.15,4.1 6.18,4.1 6.47,3.81 IC2.7 9.38,3.81 | 9.38,3.81 9.38,5.08 IC2.8
VIN
  Bottom 0.406: 25.61,10.33 25.61,13.8 24.81,14.61 24.18,14.61 23.38,15.41 23.38,16.04 22.42,16.99 21.08,16.99 20.73,16.64 18.93,16.64 11.33,24.24 11.33,26.66 10.14,27.84 F1.P$2 10.14,30.17 X2.1 | SV2.1 32.11,4.29 31.95,4.29 31,5.24 31,8.41 29.89,9.53 26.42,9.53 25.61,10.33 | 25.61,10.33 24.66,9.37 24.03,9.37 23.38,8.72 23.38,5.56 22.11,4.29 21.95,4.29 SV1.1
VIN-FUSED  (via drill 0.3 pad 0.61)
  Top 0.406: R1.1 11.49,23.5 v10.66,24.32
  Bottom 0.406: v10.66,24.32 9.96,24.32 7.61,26.67 L1.1 6.85,27.63 6.04,27.63 5.83,27.84 F1.P$1

### Text on the board
tNames: C5 | GND | C31 | R34 | R1 | R3 | C32 | C14 | nano RS485 V0.1 | C15 | ATSHA
bNames: VCC | GND | A5 | A4/SDA | VIN | A | B | GND | + | GND | A7 | SCL | A0 | SDA | A5 | SDA | A6 | SCL | Reset | - | + | A5 | D4 | - | +
Milling: Please produce the cutout
tDocu: 1 Vraw (typically unregulated voltage, either from motherboard to daughterboard or vice versa) Motherboard should have a jumper to cut onboard Vraw source if daughterboard provides Vraw. Be sure to check motherboard constraints on Vraw before connecting a daughterboard that provides Vraw (for over voltage protection). Should be able to source at least 100mA and all boards are recommended to support a voltage up to 24V on this pin. / 2 +3.3V fixed voltage (can source at least 100mA) / 3 VCCio (depending on MCU core voltage). Should not be used for heavy loads. / 4 GND / 5 MYSX_D1_DFM - Digital IO (USART TX (data from MCU)) / 6 MYSX_D2_DTM - Digital IO (USART RX (data to MCU)) / 7 MYSX_RST - Reset (On the board that carries the MCU, it is highly recommended that this pin has a 0.1uF capacitor in series for pulse “generation”) / 8 MYSX_LEGACY_ID – MYSX 1.x identification (2.0 daughterboards can tie this pin to VCC to allow the motherboard to determine if daughterboard is 1.x or 2.x. If identification is not needed or is undesired, pin can be used as regular analog input) / 9 MYSX_D3_INT - Digital IO (interrupt) / 10 MYSX_D4_INT - Digital IO (interrupt) / 11 MYSX_D5_PWM - Digital IO (PWM) / 12 MYSX_D6_PWM - Digital IO (PWM) / 13 MYSX_D7_SCL - Digital IO (I2C SCL) / 14 MYSX_D8_SDA - Digital IO (I2C SDA) / 15 MYSX_D9_A3 - Digital IO (analog input) / 16 MYSX_D10_A4 - Digital IO (analog input) / 17 MYSX_D11_MOSI - Digital IO (SPI MOSI) / 18 MYSX_D12_MISO - Digital IO (SPI MISO) / 19 MYSX_D13_SCK - Digital IO (SPI SCK) / 20 MYSX_D14_CS - Digital IO (also for SPI CS) / 21 MYSX_A5 - Analog input / 22 MYSX_A6 - Analog input